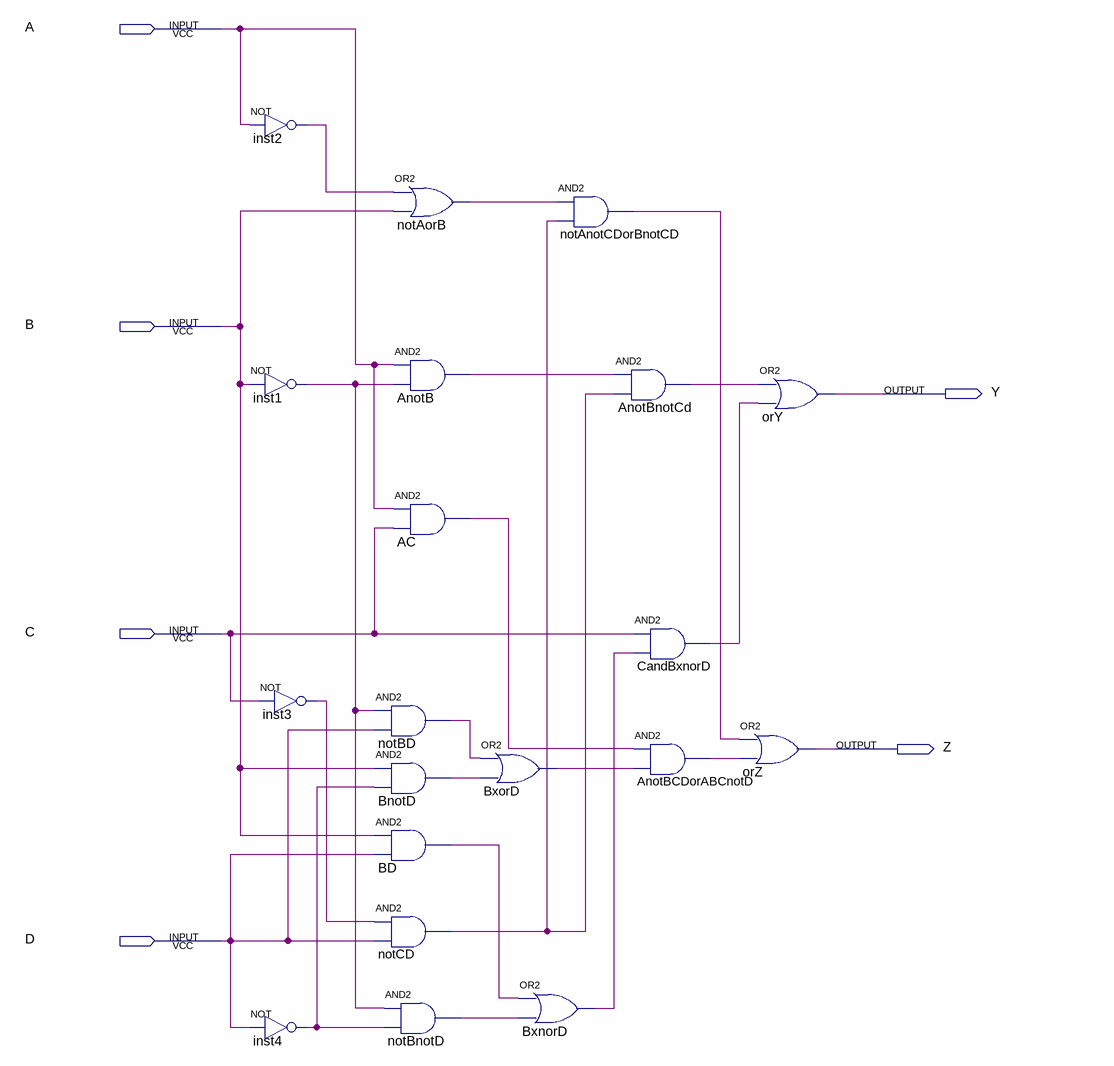
[diagram p0: schematic sheet]
// Quartus schematic guia2_funciones-logicas.bdf as structural Verilog: 20 symbols, 6 pins
module \guia2_funciones-logicas  (
  input  A,
  input  B,
  input  C,
  input  D,
  output Y,
  output Z
);

  wire AC_out, AnotB_out, AnotBCDorABCnotD_out, AnotBnotCd_out, BD_out, BnotD_out, BxnorD_out, BxorD_out,
       CandBxnorD_out, inst1_out, inst2_out, inst3_out, inst4_out, notAnotCDorBnotCD_out, notAorB_out,
       notBD_out, notBnotD_out, notCD_out;

  not inst2 (inst2_out, A);
  not inst1 (inst1_out, B);
  not inst3 (inst3_out, C);
  not inst4 (inst4_out, D);
  and notBD (notBD_out, inst1_out, D);
  and BnotD (BnotD_out, B, inst4_out);
  and BD (BD_out, B, D);
  and notCD (notCD_out, inst3_out, D);
  and notBnotD (notBnotD_out, inst1_out, inst4_out);
  or notAorB (notAorB_out, inst2_out, B);
  and AnotB (AnotB_out, A, inst1_out);
  and AC (AC_out, A, C);
  or BxorD (BxorD_out, notBD_out, BnotD_out);
  or BxnorD (BxnorD_out, BD_out, notBnotD_out);
  and notAnotCDorBnotCD (notAnotCDorBnotCD_out, notAorB_out, notCD_out);
  and AnotBnotCd (AnotBnotCd_out, AnotB_out, notCD_out);
  and CandBxnorD (CandBxnorD_out, C, BxnorD_out);
  and AnotBCDorABCnotD (AnotBCDorABCnotD_out, AC_out, BxorD_out);
  or orY (Y, AnotBnotCd_out, CandBxnorD_out);
  or orZ (Z, notAnotCDorBnotCD_out, AnotBCDorABCnotD_out);
endmodule
